# EAGLE design OpenLabKostkaSchematPomiarowy1 (EAGLE 7.5.0)
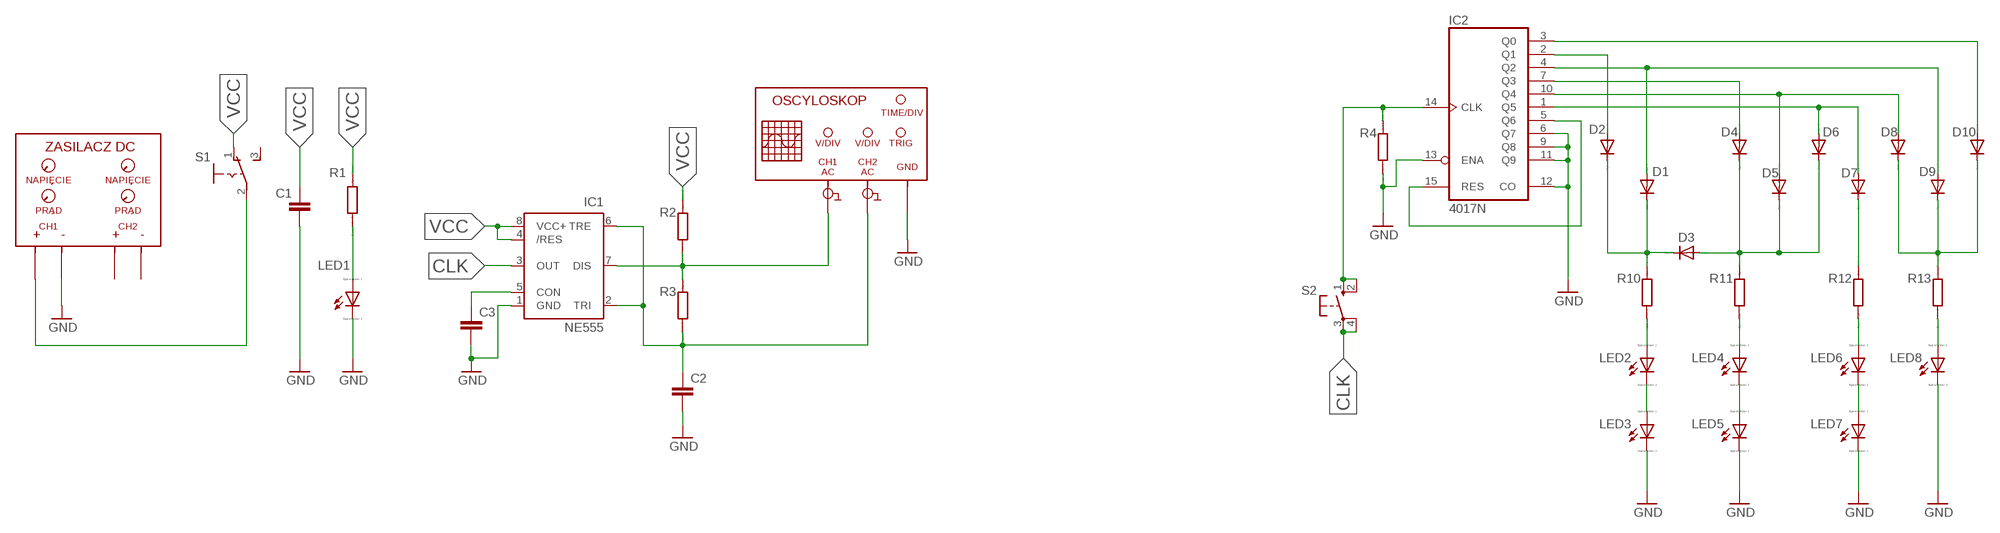
[diagram p0: schematic, sheet 1]

## Parts
C1  C5/2.5  [C5B2.5]
C2  C5/2.5  [C5B2.5]
C3  C5/2.5  [C5B2.5]
D1  1N4446  [DO35-10]
D2  1N4446  [DO35-10]
D3  1N4446  [DO35-10]
D4  1N4446  [DO35-10]
D5  1N4446  [DO35-10]
D6  1N4446  [DO35-10]
D7  1N4446  [DO35-10]
D8  1N4446  [DO35-10]
D9  1N4446  [DO35-10]
D10  1N4446  [DO35-10]
IC1  NE555  [DIL-08]
IC2  4017N  [DIL16]
LED1  LED_ELD260  [LED_LD260]
LED2  LED_ELD260  [LED_LD260]
LED3  LED_ELD260  [LED_LD260]
LED4  LED_ELD260  [LED_LD260]
LED5  LED_ELD260  [LED_LD260]
LED6  LED_ELD260  [LED_LD260]
LED7  LED_ELD260  [LED_LD260]
LED8  LED_ELD260  [LED_LD260]
R1  R0204/7  [0204/7]
R2  R0204/7  [0204/7]
R3  R0204/7  [0204/7]
R4  R0204/7  [0204/7]
R10  R0204/7  [0204/7]
R11  R0204/7  [0204/7]
R12  R0204/7  [0204/7]
R13  R0204/7  [0204/7]
S1  255SB  [255SB]
S2  10-XX  [B3F-10XX]
U$1  OSCYLOSKOP_AC_AC  [OSCYLOSKOP]
U$2  ZASILACZ  [ZASILACZ]

## Nets
CLK: IC1.3(OUT) S2.3(P) S2.4(P1)
GND [GND_I<0.5A]: C1.1 C2.2 C3.2 IC1.1(GND) IC2.6(Q7) IC2.9(Q8) IC2.11(Q9) IC2.12(CO) IC2.13(ENA) LED1.K(C) LED3.K(C) LED5.K(C) LED7.K(C) LED8.K(C) R4.1 U$1.GND U$2.C1-(CH1-)
N$1 [POWER_I<0.5A]: C2.1 IC1.2(TRI) IC1.6(TRE) R3.1 U$1.CH2
N$2: IC2.14(CLK) R4.2 S2.1(S) S2.2(S1)
N$3 [POWER_I<0.5A]: LED2.K(C) LED3.A
N$4 [POWER_I<0.5A]: IC1.7(DIS) R2.1 R3.2 U$1.CH1
N$5 [POWER_I<0.5A]: D8.C D9.C D10.C R13.2
N$6 [POWER_I<0.5A]: LED4.K(C) LED5.A
N$7 [POWER_I<0.5A]: LED6.K(C) LED7.A
N$8: S1.2(P) U$2.C1+(CH1+)
N$9 [POWER_I<0.5A]: D10.A IC2.3(Q0)
N$11 [POWER_I<0.5A]: D2.A IC2.2(Q1)
N$12: LED1.A R1.1
N$15 [POWER_I<0.5A]: LED8.A R13.1
N$16 [POWER_I<0.5A]: LED6.A R12.1
N$17 [POWER_I<0.5A]: LED4.A R11.1
N$18 [POWER_I<0.5A]: LED2.A R10.1
N$19 [POWER_I<0.5A]: D7.C R12.2
N$20 [POWER_I<0.5A]: D3.A D4.C D5.C D6.C R11.2
N$21 [POWER_0.5<I<1A]: C3.1 IC1.5(CON)
N$26 [POWER_I<0.5A]: D1.A D9.A IC2.4(Q2)
N$27 [POWER_I<0.5A]: IC2.5(Q6) IC2.15(RES)
N$28 [POWER_I<0.5A]: D4.A IC2.7(Q3)
N$29 [POWER_I<0.5A]: D5.A D8.A IC2.10(Q4)
N$30 [POWER_I<0.5A]: D6.A D7.A IC2.1(Q5)
N$31 [POWER_I<0.5A]: D1.C D2.C D3.C R10.2
VCC: C1.2 IC1.4(/RES) IC1.8(VCC+) R1.2 R2.2 S1.1(O)
Unconnected: S1.3(S) U$2.C2+(CH2+) U$2.C2-(CH2-)

## Power pins joined to a net without a drawn wire
VDD: IC2.16(VDD)
VSS: IC2.8(VSS)

## Library data of the parts
C1-C3 = capacitor-wima:C: CAPACITOR naming: grid - package width
D1-D10 = diode:1N4446: DIODE high speed (Philips)
IC1 = st-microelectronics:NE555: General purpose bipolar Timer; MF: Arrow Electronics; MPN: NE555N; OC_FARNELL: 1467742; OC_NEWARK: 89K1486
IC2 = 40xx:4017: COUNTER/DIVIDER
LED1-LED8 = eagle-ltspice:LED_E: LED Source: http://www.osram.convergy.de Source: www.luxeon.com Source: www.kingbright.com; SPICEMODEL: NONE; SPICEPREFIX: D; SPICETYPE: diode
R1-R4 R10-R13 = eagle-ltspice:R: RESISTOR, European symbol; SPICEMODEL: NONE; SPICEPREFIX: R
S1 = switch:255SB: SLIDING SWITCH Distributor Buerklin, 11G810
S2 = switch-omron:10-XX: OMRON SWITCH; MPN: B3F-1000; OC_FARNELL: 176432; OC_NEWARK: 36M3542
U$1 = Przyrzady pomiarowe:OSCYLOSKOP_AC_AC
U$2 = Przyrzady pomiarowe:ZASILACZ

## Net classes
0 default: width 0.4 mm, drill 0.1 mm, clearance 0.5 mm
1 GND_I<0.5A: width 0.8 mm, drill 0.5 mm, clearance 0.5 mm
2 GND_0.5A<I>1A: width 1.5 mm, drill 0.5 mm, clearance 0.5 mm
3 GND_1A<I>2A: width 2.5 mm, drill 0.5 mm, clearance 0.5 mm
4 GND_2A<I>4A: width 3.5 mm, drill 0.5 mm, clearance 0.5 mm
5 POWER_I<0.5A: width 0.7 mm, drill 0.5 mm, clearance 0.5 mm
6 POWER_0.5<I<1A: width 1 mm, drill 0.5 mm, clearance 0.5 mm
7 POWER_1A<I>2A: width 1.5 mm, drill 0.5 mm, clearance 0.5 mm
8 POWER_2A<I>3A: width 2.5 mm, drill 0.5 mm, clearance 0.5 mm
9 SIGNAL: width 0.4 mm, drill 0.5 mm, clearance 0.5 mm

## Board
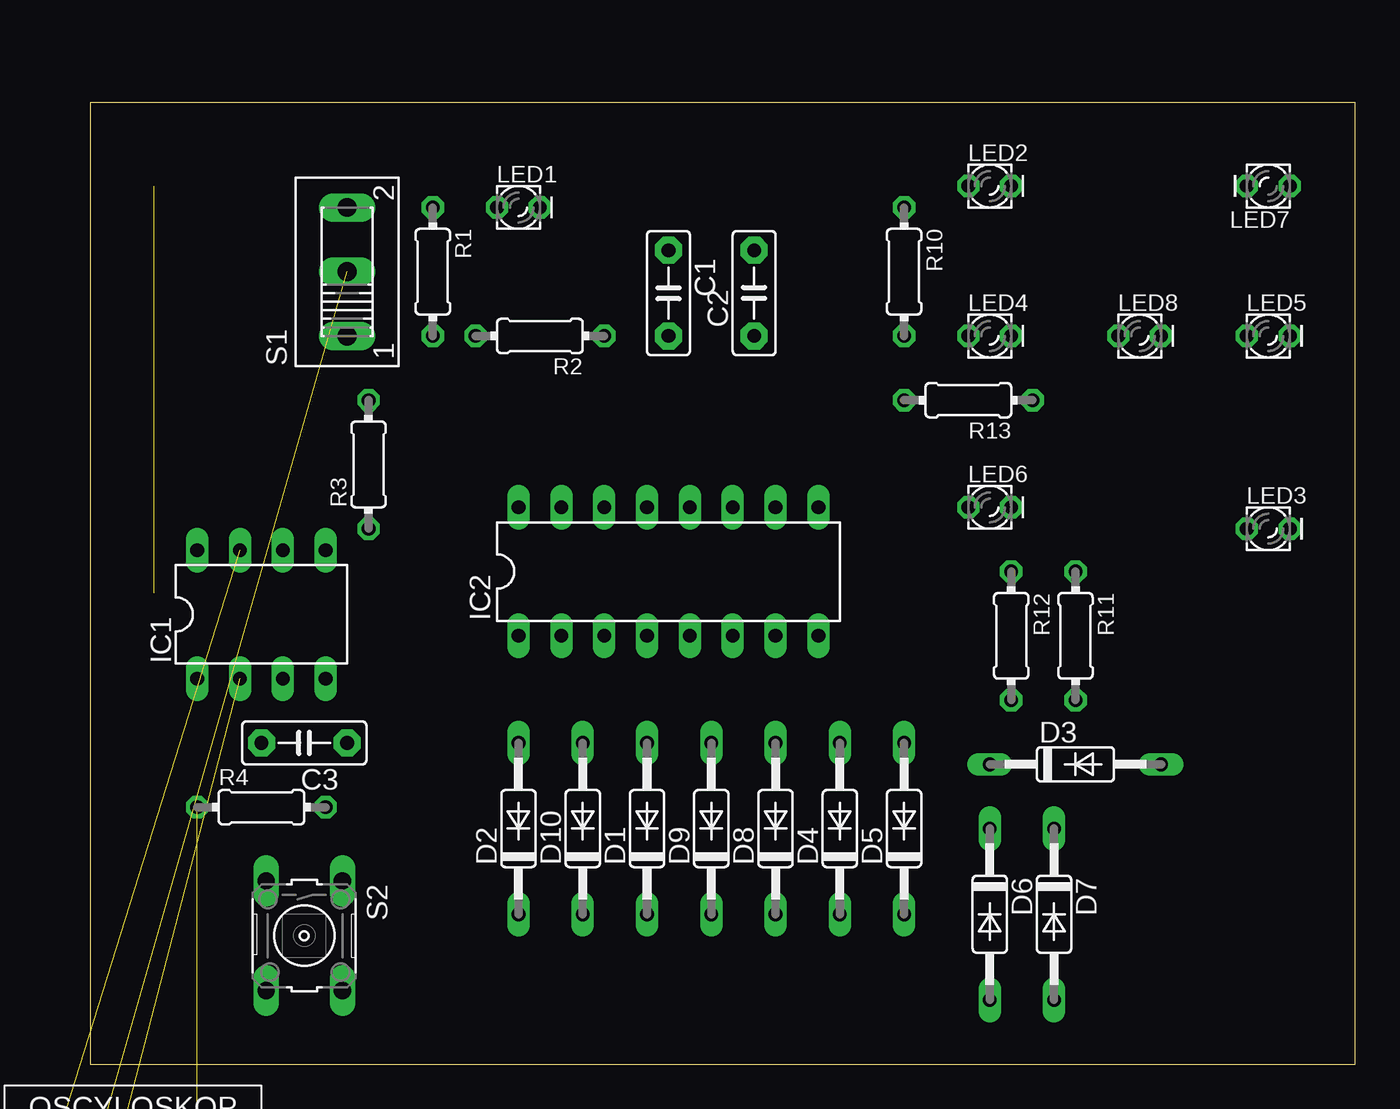
[diagram p1: board, top side]
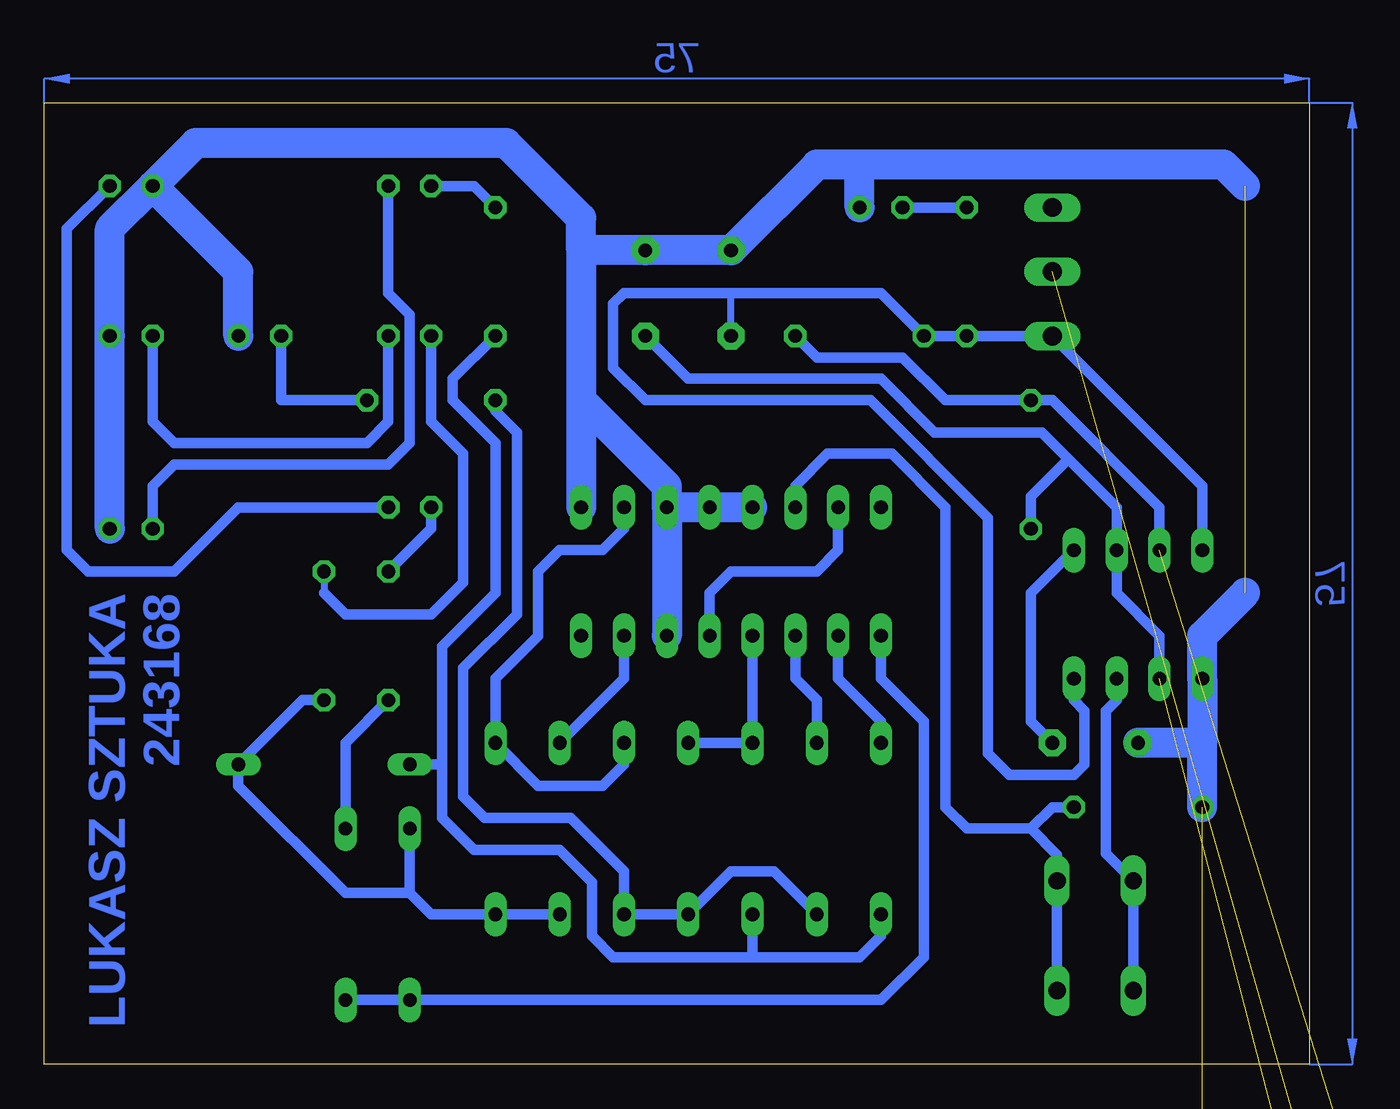
[diagram p2: board, bottom side, seen from below]

Size 75 x 57 mm. Coordinates in mm from the lower left corner, seen from the top.
Outline: 0,0 75,0 75,57 0,57 0,0
Copper layers (1*16): Top 0.035mm / dielectric 1.5mm / Bottom 0.035mm
Design rules "OpenLab": minimum track width 0.4mm, minimum drill 0.6mm, track to track 0.5mm, track to pad 0.5mm, pad to pad 0.5mm, via to via 0.5mm, smd to smd 0.1mm, copper to edge 2mm, drill to drill 0.2mm, minimum pad ring 10mil, minimum via ring 8mil, stop-mask expansion 4mil, vias tented up to drill 0mil, thermal gap 10mil

### Footprints (pad centres in the part's own frame; a part is rotated, then mirrored left to right if it is on the bottom)
C5B2.5 = drill 0.813 pad 1.6 octagon: 1 -2.54,0; 2 2.54,0
DO35-10 = drill 0.813 long: A 5.08,0; C -5.08,0
DIL-08 = drill 0.813 long: 1 -3.81,-3.81; 2 -1.27,-3.81; 3 1.27,-3.81; 4 3.81,-3.81; 5 3.81,3.81; 6 1.27,3.81; 7 -1.27,3.81; 8 -3.81,3.81
DIL16 = drill 0.813 long: 1 -8.89,-3.81; 2 -6.35,-3.81; 3 -3.81,-3.81; 4 -1.27,-3.81; 5 1.27,-3.81; 6 3.81,-3.81; 7 6.35,-3.81; 8 8.89,-3.81; 9 8.89,3.81; 10 6.35,3.81; 11 3.81,3.81; 12 1.27,3.81; 13 -1.27,3.81; 14 -3.81,3.81; 15 -6.35,3.81; 16 -8.89,3.81
LED_LD260 = drill 0.813 octagon: A -1.27,0; K 1.27,0
0204/7 = drill 0.813 octagon: 1 -3.81,0; 2 3.81,0
255SB = drill 1.118 long: 1 -3.81,0; 2 0,0; 3 3.81,0
B3F-10XX = drill 1.016 long: 1 -3.251,2.261; 2 3.251,2.261; 3 -3.251,-2.261; 4 3.251,-2.261
OSCYLOSKOP = drill 0.8 offset: CH1 -5.08,-1.27; CH2 -1.27,-1.27; GND 3.81,-1.27
ZASILACZ = drill 0.8 offset: C1+ -5.08,-1.27; C1- -1.27,-1.27; C2+ 2.54,-1.27; C2- 6.35,-1.27

### Placement (x,y rotation side)
C1  34.29,45.72 270 top
C2  39.37,45.72 90 top
C3  12.7,19.05 180 top
D1  33.02,13.97 90 top
D2  25.4,13.97 90 top
D3  58.42,17.78 0 top
D4  44.45,13.97 90 top
D5  48.26,13.97 90 top
D6  53.34,8.89 270 top
D7  57.15,8.89 270 top
D8  40.64,13.97 90 top
D9  36.83,13.97 90 top
D10  29.21,13.97 90 top
IC1  10.16,26.67 0 top
IC2  34.29,29.21 0 top
LED1  25.4,50.8 0 top
LED2  53.34,52.07 0 top
LED3  69.85,31.75 0 top
LED4  53.34,43.18 0 top
LED5  69.85,43.18 0 top
LED6  53.34,33.02 0 top
LED7  69.85,52.07 180 top
LED8  62.23,43.18 0 top
R1  20.32,46.99 270 top
R2  26.67,43.18 180 top
R3  16.51,35.56 90 top
R4  10.16,15.24 0 top
R10  48.26,46.99 270 top
R11  58.42,25.4 270 top
R12  54.61,25.4 270 top
R13  52.07,39.37 180 top
S1  15.24,46.99 90 top
S2  12.7,7.62 270 top
U$1  2.54,-5.08 0 top  (outside the outline)
U$2  2.54,-13.97 0 top  (outside the outline)

### Tracks (layer width: path | path; a pad name or v marks a point on that pad's centre or on a via)
CLK
  Bottom 0.61: S2.4 S2.3 12.06,12.5 12.06,20.95 11.43,21.59 IC1.3
GND  (3 unrouted)
  Bottom 1.778: 43.18,48.26 C2.2 C1.1 29.21,53.34 26.67,53.34 | 43.18,48.26 43.18,39.37 | 43.18,39.37 IC2.9 | IC2.11 IC2.6 | 3.81,27.94 6.35,25.4 IC1.1 6.35,19.05 | 6.35,19.05 C3.2 | 3.81,52.07 5.08,53.34 26.67,53.34 | LED1.K 26.67,53.34 | LED3.K LED5.K 71.12,49.53 LED7.K | LED8.K 63.5,46.99 LED7.K | LED7.K 66.04,54.61 47.62,54.61 43.18,50.16 43.18,48.26 | IC2.11 IC2.12 IC2.13 | IC2.11 38.1,34.29 43.18,39.37 | R4.1 6.35,19.05
N$1  (1 unrouted)
  Bottom 0.61: IC1.2 8.89,25.4 11.43,27.94 IC1.6 11.43,33.02 14.29,35.88 | 14.29,35.88 15.88,37.47 22.23,37.47 25.4,40.64 36.83,40.64 C2.1 | R3.1 16.51,33.66 14.29,35.88
N$2
  Bottom 0.61: S2.2 S2.1 14.96,12.42 16.51,13.97 | 16.51,13.97 20.32,13.97 21.59,15.24 21.59,33.02 24.77,36.2 28.57,36.2 30.48,34.29 IC2.14 | R4.2 15.24,15.24 16.51,13.97
N$3
  Bottom 0.61: LED2.K 54.61,45.72 53.34,44.45 53.34,36.83 54.61,35.56 67.31,35.56 68.58,34.29 LED3.A
N$4  (1 unrouted)
  Bottom 0.61: IC1.7 8.89,33.02 15.24,39.37 R3.2 21.59,39.37 24.13,41.91 29.21,41.91 R2.1
N$5
  Bottom 0.61: D10.C 31.75,11.43 34.29,11.43 D9.C D8.C 40.64,11.43 43.81,14.61 48.9,14.61 50.16,15.88 50.16,23.5 46.99,26.67 46.99,37.47 48.26,38.73 R13.2
N$6
  Bottom 0.61: LED4.K 54.61,38.1 55.88,36.83 67.31,36.83 68.58,38.1 LED5.A
N$7
  Bottom 0.61: LED7.A 73.66,49.53 73.66,30.48 72.39,29.21 67.31,29.21 63.5,33.02 LED6.K
N$8  (1 unrouted)
N$9
  Bottom 0.61: IC2.3 30.48,22.86 29.21,21.59 D10.A
N$11
  Bottom 0.61: IC2.2 27.94,22.86 25.4,20.32 D2.A
N$12
  Bottom 0.61: R1.1 LED1.A
N$15
  Bottom 0.61: LED8.A 60.96,39.37 R13.1
N$16
  Bottom 0.61: LED6.A 52.07,31.75 R12.1
N$17
  Bottom 0.406: R11.1 58.42,27.94
  Bottom 0.61: 58.42,27.94 57.15,26.67 52.07,26.67 50.16,28.57 50.16,36.2 52.07,38.1 LED4.A
N$18
  Bottom 0.61: LED2.A 49.53,52.07 R10.1
N$19
  Bottom 0.61: R12.2 57.15,19.05 D7.C
N$20
  Bottom 0.61: D4.C D5.C 52.07,8.89 53.34,10.16 | 53.34,10.16 D6.C | 53.34,10.16 57.15,10.16 63.5,16.51 D3.A 59.69,21.59 R11.2
N$21
  Bottom 0.61: C3.1 16.51,20.32 16.51,27.94 IC1.5
N$26
  Bottom 0.61: IC2.4 D1.A D9.A
N$27
  Bottom 0.61: IC2.15 27.94,30.48 29.21,29.21 34.29,29.21 35.56,27.94 IC2.5
N$28
  Bottom 0.61: IC2.7 40.64,22.86 D4.A
N$29
  Bottom 0.61: IC2.10 40.64,31.75 41.91,30.48 44.45,30.48 45.72,29.21 45.72,25.4 48.26,22.86 D5.A 45.72,16.51 41.91,16.51 40.64,17.78 D8.A
N$30
  Bottom 0.61: IC2.1 25.4,22.86 22.86,20.32 22.86,6.35 25.4,3.81 D6.A D7.A
N$31
  Bottom 0.61: D2.C 25.4,7.62 26.67,6.35 33.02,6.35 | D1.C 33.02,6.35 | 33.02,6.35 41.27,6.35 42.55,7.62 42.55,10.79 44.45,12.7 49.53,12.7 51.44,14.61 51.44,17.78 | R10.2 50.8,40.64 50.8,39.37 48.26,36.83 48.26,27.94 51.44,24.77 51.44,17.78 | D3.C 51.44,17.78
VCC
  Bottom 0.406: C1.2 34.29,45.72
  Bottom 0.61: IC1.4 13.97,21.59 13.34,20.95 13.34,17.78 13.97,17.14 17.78,17.14 19.05,18.41 19.05,32.38 26.04,39.37 39.37,39.37 41.27,41.27 41.27,45.09 40.64,45.72 34.29,45.72 25.4,45.72 R2.2 R1.2 S1.1 6.35,34.29 IC1.8
(copper drawn outside any net)
  shapes: Bottom area x2

### Text on the board
Bottom: LUKASZ SZTUKA / 243168